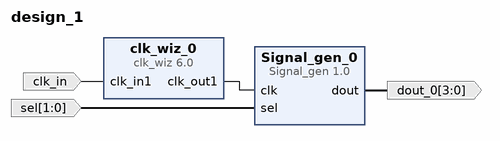
[diagram p0: block diagram of the top level]
# Vivado block design design_1, xcku5p-ffvb676-2-e, Vivado 2020.2
create_bd_design design_1

create_bd_port -dir I -type clk clk_in
create_bd_port -dir I -from 1 -to 0 sel
create_bd_port -dir O -from 3 -to 0 dout_0

create_bd_cell -type ip -vlnv xilinx.com:user:Signal_gen:1.0 Signal_gen_0
create_bd_cell -type ip -vlnv xilinx.com:ip:clk_wiz:6.0 clk_wiz_0
set_property -dict [list \
  CONFIG.CLKOUT1_JITTER 460.700 \
  CONFIG.CLKOUT1_PHASE_ERROR 523.418 \
  CONFIG.CLKOUT1_REQUESTED_OUT_FREQ 10 \
  CONFIG.MMCM_CLKFBOUT_MULT_F 92.375 \
  CONFIG.MMCM_CLKOUT0_DIVIDE_F 92.375 \
  CONFIG.MMCM_DIVCLK_DIVIDE 10 \
  CONFIG.USE_LOCKED false \
  CONFIG.USE_RESET false \
] [get_bd_cells clk_wiz_0]

# ---- connections ----

connect_bd_net -net clk_in1_0_1 [get_bd_ports clk_in] [get_bd_pins clk_wiz_0/clk_in1]
connect_bd_net [get_bd_pins clk_wiz_0/clk_out1] [get_bd_pins Signal_gen_0/clk]
connect_bd_net -net sel_0_1 [get_bd_ports sel] [get_bd_pins Signal_gen_0/sel]
connect_bd_net [get_bd_pins Signal_gen_0/dout] [get_bd_ports dout_0]

validate_bd_design
save_bd_design
